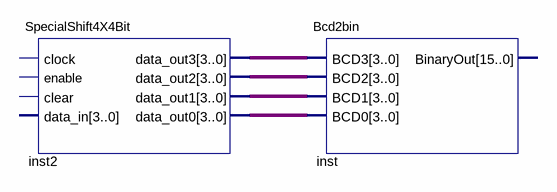
[diagram p0: schematic sheet]
// Quartus schematic Calculator.bdf as structural Verilog: 2 symbols, 0 pins
module Calculator (
);

  wire [3:0] inst2_data_out0, inst2_data_out1, inst2_data_out2, inst2_data_out3;

  SpecialShift4X4Bit inst2 (
    .data_out3(inst2_data_out3), .data_out2(inst2_data_out2), .data_out1(inst2_data_out1),
    .data_out0(inst2_data_out0));  // open: clock, enable, clear, data_in
  Bcd2bin inst (
    .BCD3(inst2_data_out3), .BCD2(inst2_data_out2), .BCD1(inst2_data_out1), .BCD0(inst2_data_out0));  // open: BinaryOut
endmodule
